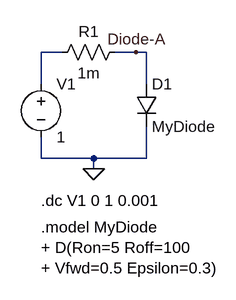
[diagram p0: schematic Fig_2-121_Diode_Test_MyDiode_Epsilon.asc]
Fig_2-121_Diode_Test_MyDiode_Epsilon.asc, the LTspice schematic file:
Version 4
SHEET 1 988 680
WIRE 160 80 128 80
WIRE 272 80 240 80
WIRE 288 80 272 80
WIRE 128 128 128 80
WIRE 288 128 288 80
WIRE 128 240 128 208
WIRE 208 240 128 240
WIRE 288 240 288 192
WIRE 288 240 208 240
WIRE 208 256 208 240
FLAG 208 256 0
FLAG 272 80 Diode-A
SYMBOL diode 272 128 R0
SYMATTR InstName D1
SYMATTR Value MyDiode
SYMBOL voltage 128 112 R0
SYMATTR InstName V1
SYMATTR Value 1
SYMBOL res 144 96 R270
WINDOW 0 32 56 VTop 2
WINDOW 3 0 56 VBottom 2
SYMATTR InstName R1
SYMATTR Value 1m
TEXT 128 304 Left 2 !.dc V1 0 1 0.001
TEXT 128 344 Left 2 !.model MyDiode\n+ D(Ron=5 Roff=100\n+ Vfwd=0.5 Epsilon=0.3)

The netlist it stands for:
* Fig_2-121_Diode_Test_MyDiode_Epsilon.asc
D1 Diode-A 0 MyDiode
V1 N001 0 1
R1 N001 Diode-A 1m
.model D D
.lib standard.dio
.dc V1 0 1 0.001
.model MyDiode
+ D(Ron=5 Roff=100
+ Vfwd=0.5 Epsilon=0.3)
.backanno
.end